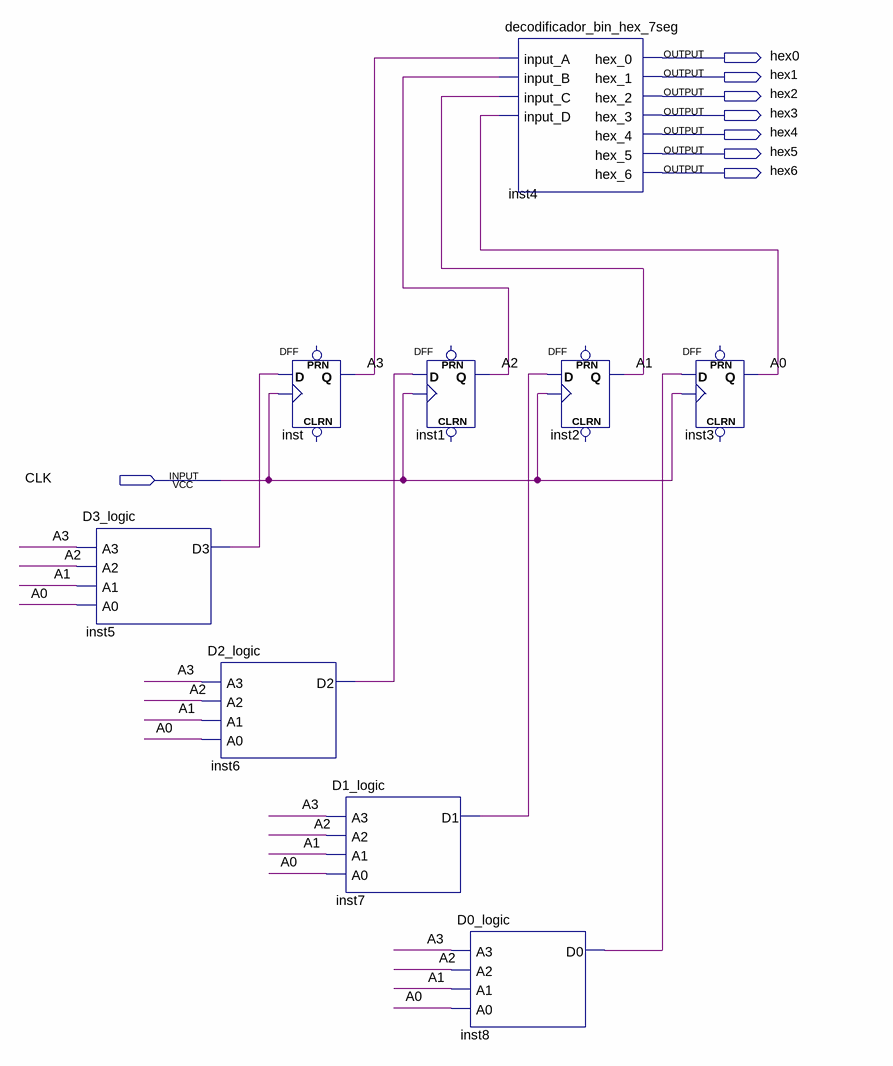
[diagram p0: schematic sheet]
// Quartus schematic Lab5_schem_yuji.bdf as structural Verilog: 9 symbols, 8 pins
module Lab5_schem_yuji (
  input  CLK,
  output hex0,
  output hex1,
  output hex2,
  output hex3,
  output hex4,
  output hex5,
  output hex6
);

  wire A0, A1, A2, A3, inst5_d3, inst6_d2, inst7_d1, inst8_d0;

  D3_logic inst5 (.A3(A3), .A2(A2), .A1(A1), .A0(A0), .D3(inst5_d3));
  D2_logic inst6 (.A3(A3), .A2(A2), .A1(A1), .A0(A0), .D2(inst6_d2));
  DFF inst (.CLK(CLK), .D(inst5_d3), .Q(A3));  // open: CLRN, PRN
  D1_logic inst7 (.A3(A3), .A2(A2), .A1(A1), .A0(A0), .D1(inst7_d1));
  DFF inst1 (.CLK(CLK), .D(inst6_d2), .Q(A2));  // open: CLRN, PRN
  D0_logic inst8 (.A3(A3), .A2(A2), .A1(A1), .A0(A0), .D0(inst8_d0));
  decodificador_bin_hex_7seg inst4 (
    .input_A(A3), .input_B(A2), .input_C(A1), .input_D(A0), .hex_0(hex0), .hex_1(hex1), .hex_2(hex2),
    .hex_3(hex3), .hex_4(hex4), .hex_5(hex5), .hex_6(hex6));
  DFF inst2 (.CLK(CLK), .D(inst7_d1), .Q(A1));  // open: CLRN, PRN
  DFF inst3 (.CLK(CLK), .D(inst8_d0), .Q(A0));  // open: CLRN, PRN
endmodule
